# EAGLE schematic tcore (EAGLE 7.4.0)
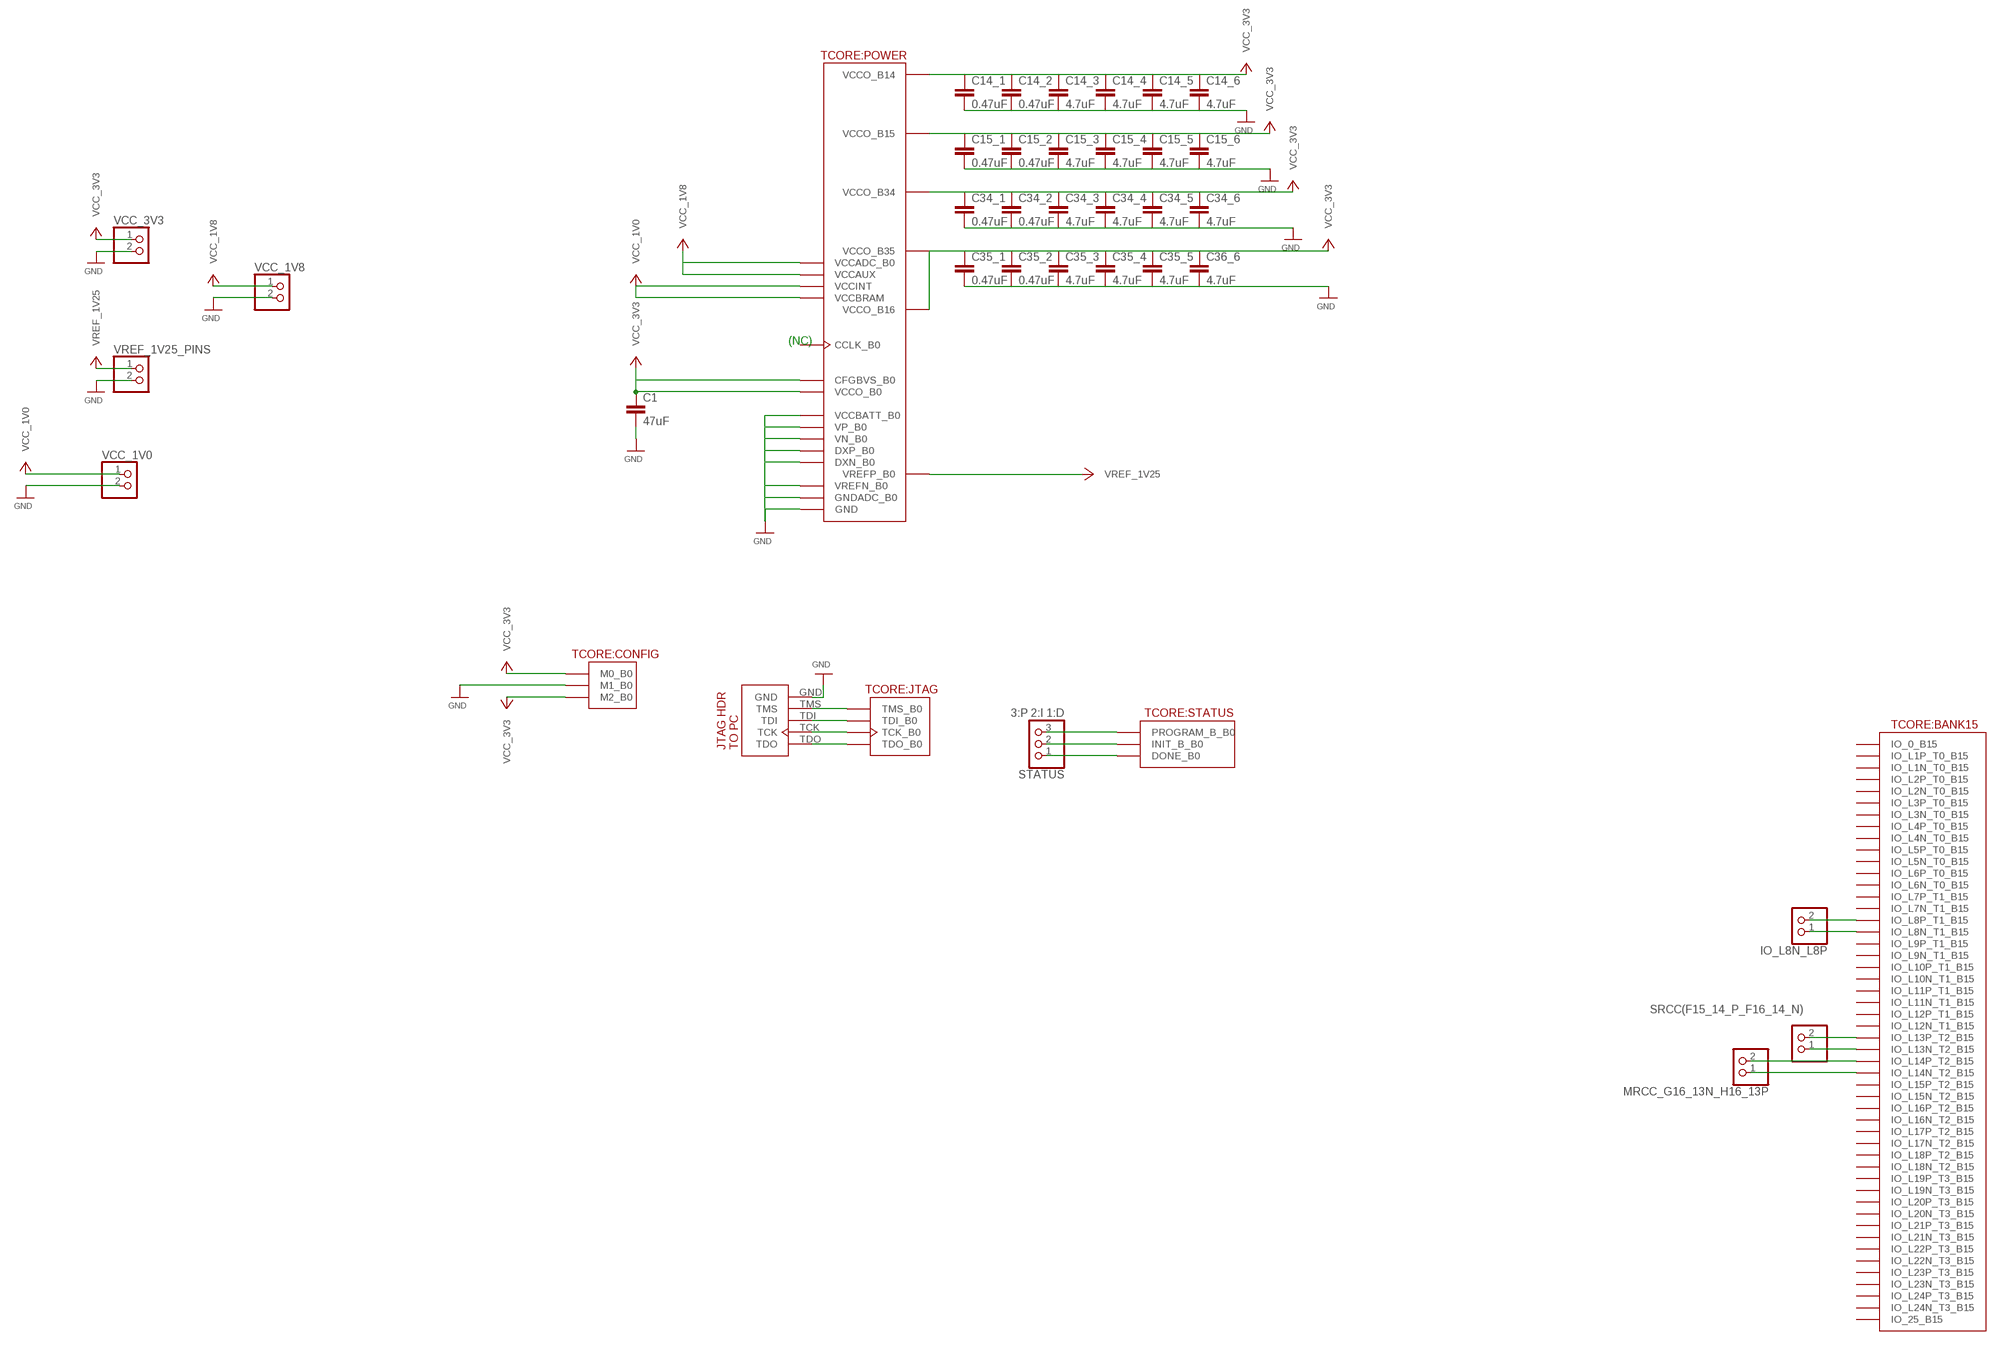
[diagram p0: schematic, sheet 1]

## Parts
C1  47uF  C-EUC1206  [C1206]
C14_1  0.47uF  C-EUC1206  [C1206]
C14_2  0.47uF  C-EUC1206  [C1206]
C14_3  4.7uF  C-EUC1206  [C1206]
C14_4  4.7uF  C-EUC1206  [C1206]
C14_5  4.7uF  C-EUC1206  [C1206]
C14_6  4.7uF  C-EUC1206  [C1206]
C15_1  0.47uF  C-EUC1206  [C1206]
C15_2  0.47uF  C-EUC1206  [C1206]
C15_3  4.7uF  C-EUC1206  [C1206]
C15_4  4.7uF  C-EUC1206  [C1206]
C15_5  4.7uF  C-EUC1206  [C1206]
C15_6  4.7uF  C-EUC1206  [C1206]
C34_1  0.47uF  C-EUC1206  [C1206]
C34_2  0.47uF  C-EUC1206  [C1206]
C34_3  4.7uF  C-EUC1206  [C1206]
C34_4  4.7uF  C-EUC1206  [C1206]
C34_5  4.7uF  C-EUC1206  [C1206]
C34_6  4.7uF  C-EUC1206  [C1206]
C35_1  0.47uF  C-EUC1206  [C1206]
C35_2  0.47uF  C-EUC1206  [C1206]
C35_3  4.7uF  C-EUC1206  [C1206]
C35_4  4.7uF  C-EUC1206  [C1206]
C35_5  4.7uF  C-EUC1206  [C1206]
C36_6  4.7uF  C-EUC1206  [C1206]
IO_L8N_L8P  PINHD-1X2  [1X02]
JTAG_HEADER1  JTAG_HEADER  [JTAG_HDR]
MRCC_G16_13N_H16_13P  PINHD-1X2  [1X02]
SRCC(F15_14_P_F16_14_N)  PINHD-1X2  [1X02]
STATUS  3:P 2:I 1:D  PINHD-1X3  [1X03]
TCORE  TCORECFG324  [TCORE_PAC]
VCC_1V0  PINHD-1X2  [1X02]
VCC_1V8  PINHD-1X2  [1X02]
VCC_3V3  PINHD-1X2  [1X02]
VREF_1V25_PINS  PINHD-1X2  [1X02]

## Nets
GND: C1.2 C14_1.2 C15_1.2 C34_1.2 C35_1.2 JTAG_HEADER1.GND TCORE.E08@VCCBATT_B0(VCCBATT_B0) TCORE.H09@GNDADC_B0(GNDADC_B0) TCORE.J09@VREFN_0(VREFN_B0) TCORE.J10@VP_0(VP_B0) TCORE.K09@VN_B0(VN_B0) TCORE.L09@DXN_B0(DXN_B0) TCORE.L10@DXP_B0(DXP_B0) TCORE.P13@M1_B0(M1_B0) VCC_1V0.2 VCC_1V8.2 VCC_3V3.2 VREF_1V25_PINS.2
N$3: JTAG_HEADER1.TDO TCORE.E13@TDO_B0(TDO_B0)
N$4: JTAG_HEADER1.TCK TCORE.E10@TCK_B0(TCK_B0)
N$5: JTAG_HEADER1.TDI TCORE.E11@TDI_B0(TDI_B0)
N$6: JTAG_HEADER1.TMS TCORE.E12@TMS_B0(TMS_B0)
N$11: STATUS.3 TCORE.P09@PROGRAM_B_B0(PROGRAM_B_B0)
N$15: STATUS.2 TCORE.P07@INIT_B_B0(INIT_B_B0)
N$16: STATUS.1 TCORE.P10@DONE_B0(DONE_B0)
N$20: IO_L8N_L8P.2 TCORE.A15@IO_L8P_T1_B15(IO_L8P_T1_B15)
N$23: MRCC_G16_13N_H16_13P.1 TCORE.F16@IO_L14N_T2_B15(IO_L14N_T2_B15)
N$24: MRCC_G16_13N_H16_13P.2 TCORE.F15@IO_L14P_T2_B15(IO_L14P_T2_B15)
N$25: SRCC(F15_14_P_F16_14_N).1 TCORE.G16@IO_L13N_T2_B15(IO_L13N_T2_B15)
N$26: SRCC(F15_14_P_F16_14_N).2 TCORE.H16@IO_L13P_T2_B15(IO_L13P_T2_B15)
N$28: IO_L8N_L8P.1 TCORE.A16@IO_L8N_T1_B15(IO_L8N_T1_B15)
VCC_1V0 [VCC_1V0]: TCORE.F08@VCCINT(VCCINT) TCORE.F10@VCCBRAM(VCCBRAM) TCORE.G07@VCCINT(VCCINT) TCORE.G09@VCCINT(VCCINT) TCORE.G11@VCCBRAM(VCCBRAM) TCORE.H08@VCCINT(VCCINT) TCORE.J07@VCCINT(VCCINT) TCORE.J11@VCCINT(VCCINT) TCORE.K08@VCCINT(VCCINT) TCORE.L07@VCCINT(VCCINT) TCORE.L11@VCCINT(VCCINT) TCORE.M08@VCCINT(VCCINT) TCORE.M10@VCCINT(VCCINT) TCORE.N07@VCCINT(VCCINT) TCORE.N09@VCCINT(VCCINT) TCORE.N11@VCCINT(VCCINT) VCC_1V0.1
VCC_1V8: TCORE.F12@VCCAUX(VCCAUX) TCORE.H10@VCCADC_B0(VCCADC_B0) TCORE.H12@VCCAUX(VCCAUX) TCORE.K12@VCCAUX(VCCAUX) TCORE.M12@VCCAUX(VCCAUX) VCC_1V8.1
VCC_3V3: TCORE.P11@M2_B0(M2_B0) TCORE.P12@M0_B0(M0_B0)
VCCO_B14 [VCC_3V3]: C1.1 TCORE.B10@VCCO_B16(VCCO_B16) TCORE.L17@VCCO_B14(VCCO_B14) TCORE.N13@VCCO_14(VCCO_B14) TCORE.P08@CFGBVS_0B(CFGBVS_B0) TCORE.P16@VCCO_14(VCCO_B14) TCORE.R09@VCCO_B0(VCCO_B0) TCORE.T12@VCCO_B14(VCCO_B14) TCORE.U15@VCCO_B14(VCCO_B14) TCORE.V18@VCCO_B14(VCCO_B14) VCC_3V3.1 ; supply symbol labelled VCC_3V3
VREF_1V25 [VREF_1V25]: TCORE.K10@VREFP_B0(VREFP_B0) VREF_1V25_PINS.1
Unconnected: C14_1.1 C14_2.1 C14_2.2 C14_3.1 C14_3.2 C14_4.1 C14_4.2 C14_5.1 C14_5.2 C14_6.1 C14_6.2 C15_1.1 C15_2.1 C15_2.2 C15_3.1 C15_3.2 C15_4.1 C15_4.2 C15_5.1 C15_5.2 C15_6.1 C15_6.2 C34_1.1 C34_2.1 C34_2.2 C34_3.1 C34_3.2 C34_4.1 C34_4.2 C34_5.1 C34_5.2 C34_6.1 C34_6.2 C35_1.1 C35_2.1 C35_2.2 C35_3.1 C35_3.2 C35_4.1 C35_4.2 C35_5.1 C35_5.2 C36_6.1 C36_6.2 TCORE.A01@IO_L9N_T1_B35(IO_L9N_T1_B35) TCORE.A03@IO_L8N_T1_B35(IO_L8N_T1_B35) TCORE.A04@IO_L8P_T1_B35(IO_L8P_T1_B35) TCORE.A05@IO_L3N_T0_B35(IO_L3N_T0_B35) TCORE.A06@IO_L3P_T0_B35(IO_L3P_T0_B35) TCORE.A08@IO_L12N_T1_B16(IO_L12N_T1_B16) TCORE.A09@IO_L14N_T2_B16(IO_L14N_T2_B16) TCORE.A10@IO_L14P_T2_B16(IO_L14P_T2_B16) TCORE.A11@IO_L4N_T0_B15(IO_L4N_T0_B15) TCORE.A13@IO_L9P_T1_B15(IO_L9P_T1_B15) TCORE.A14@IO_L9N_T1_B15(IO_L9N_T1_B15) TCORE.A18@IO_L10N_T1_B15(IO_L10N_T1_B15) TCORE.B01@IO_L9P_T1_B35(IO_L9P_T1_B35) TCORE.B02@IO_L10N_T1_B35(IO_L10N_T1_B35) TCORE.B03@IO_L10P_T1_B35(IO_L10P_T1_B35) TCORE.B04@IO_L7N_T1_B35(IO_L7N_T1_B35) TCORE.B06@IO_L2N_T0_B35(IO_L2N_T0_B35) TCORE.B07@IO_L2P_T0_B35(IO_L2P_T0_B35) TCORE.B08@IO_L12P_T1_B16(IO_L12P_T1_B16) TCORE.B09@IO_L11N_T1_B16(IO_L11N_T1_B16) TCORE.B11@IO_L4P_T0_B15(IO_L4P_T0_B15) TCORE.B12@IO_L3N_T0_B15(IO_L3N_T0_B15) TCORE.B13@IO_L2P_T0_B15(IO_L2P_T0_B15) TCORE.B14@IO_L2N_T0_B15(IO_L2N_T0_B15) TCORE.B16@IO_L7P_T1_B15(IO_L7P_T1_B15) TCORE.B17@IO_L7N_T1_B15(IO_L7N_T1_B15) TCORE.B18@IO_L10P_T1_B15(IO_L10P_T1_B15) TCORE.C01@IO_L16N_T2_B35(IO_L16N_T2_B35) TCORE.C02@IO_L16P_T2_B35(IO_L16P_T2_B35) TCORE.C04@IO_L7P_T1_B35(IO_L7P_T1_B35) TCORE.C05@IO_L1N_T0_B35(IO_L1N_T0_B35) TCORE.C06@IO_L1P_T0_B35(IO_L1P_T0_B35) TCORE.C07@IO_L4N_T0_B35(IO_L4N_T0_B35) TCORE.C09@IO_L11P_T1_B16(IO_L11P_T1_B16) TCORE.C10@IO_L13N_T2_B16(IO_L13N_T2_B16) TCORE.C11@IO_L13P_T2_B16(IO_L13P_T2_B16) TCORE.C12@IO_L3P_T0_B15(IO_L3P_T0_B15) TCORE.C14@IO_L1N_T0_B15(IO_L1N_T0_B15) TCORE.C15@IO_L12N_T1_B15(IO_L12N_T1_B15) TCORE.C16@IO_L20P_T3B15(IO_L20P_T3_B15) TCORE.C17@IO_L20N_T3_B15(IO_L20N_T3_B15) TCORE.D02@IO_L14N_T2_B35(IO_L14N_T2_B35) TCORE.D03@IO_L12N_T1_B35(IO_L12N_T1_B35) TCORE.D04@IO_L11N_T1_B35(IO_L11N_T1_B35) TCORE.D05@IO_L11P_T1_B35(IO_L11P_T1_B35) TCORE.D07@IO_L6N_T0_VREF_B35(IO_L6N_T0_B35) TCORE.D08@IO_L4P_T0_B35(IO_L4P_T0_B35) TCORE.D09@IO_L6N_T0_VREF_B16(IO_L6N_T0_B16) TCORE.D10@IO_L19N_T3_VREF_B16(IO_L19N_T3_B16) TCORE.D12@IO_L6P_T0_B15(IO_L6P_T0_B15) TCORE.D13@IO_L6N_T0_VREF_B15(IO_L6N_T0_B15) TCORE.D14@IO_L1P_T0_B15(IO_L1P_T0_B15) TCORE.D15@IO_L12P_T1_B15(IO_L12P_T1_B15) TCORE.D17@IO_L16N_T2_B15(IO_L16N_T2_B15) TCORE.D18@IO_L21N_T3_B15(IO_L21N_T3_B15) TCORE.E01@IO_L18N_T2_B35(IO_L18N_T2_B35) TCORE.E02@IO_L14P_T2_B35(IO_L14P_T2_B35) TCORE.E03@IO_L12P_T1_B35(IO_L12P_T1_B35) TCORE.E05@IO_L5N_T0_B35(IO_L5N_T0_B35) TCORE.E06@IO_L5P_T0_B35(IO_L5P_T0_B35) TCORE.E07@IO_L6P_T0_B35(IO_L6P_T0_B35) TCORE.E09@CCLK_B0(CCLK_B0) TCORE.E15@IO_L11P_T1_B15(IO_L11P_T1_B15) TCORE.E16@IO_L11N_T1_B15(IO_L11N_T1_B15) TCORE.E17@IO_L16P_T2_B15(IO_L16P_T2_B15) TCORE.E18@IO_L21P_T3_B15(IO_L21P_T3_B15) TCORE.F01@IO_L18P_T2_B35(IO_L18P_T2_B35) TCORE.F03@IO_L13N_T2_B35(IO_L13N_T2_B35) TCORE.F04@IO_L13P_T2_B35(IO_L13P_T2_B35) TCORE.F05@IO_0_B35(IO_0_B35) TCORE.F06@IO_L19N_T3_VREF_B35(IO_L19N_T3_B35) TCORE.F13@IO_L5P_T0_B15(IO_L5P_T0_B15) TCORE.F14@IO_L5N_T0_B15(IO_L5N_T0_B15) TCORE.F18@IO_L22N_T3_B15(IO_L22N_T3_B15) TCORE.G01@IO_L17N_T2_B35(IO_L17N_T2_B35) TCORE.G02@IO_L15N_T2_B5(IO_L15N_T2_B35) TCORE.G03@IO_L20N_T3_B35(IO_L20N_T3_B35) TCORE.G04@IO_L20P_T3_B35(IO_L20P_T3_B35) TCORE.G06@IO_L19P_T3_B35(IO_L19P_T3_B35) TCORE.G13@IO_0_B15(IO_0_B15) TCORE.G14@IO_L15N_T2_B15(IO_L15N_T2_B15) TCORE.G17@IO_L18N_T2_B15(IO_L18N_T2_B15) TCORE.G18@IO_L22P_T3_B15(IO_L22P_T3_B15) TCORE.H01@IO_L17P_T2_B35(IO_L17P_T2_B35) TCORE.H02@IO_L15P_T2_B35(IO_L15P_T2_B35) TCORE.H04@IO_L21N_T3_B35(IO_L21N_T3_B35) TCORE.H05@IO_L24N_T3_B35(IO_L24N_T3_B35) TCORE.H06@IO_L24P_T3_B35(IO_L24P_T3_B35) TCORE.H14@IO_L15P_T2_B15(IO_L15P_T2_B15) TCORE.H15@IO_L19N_T3_VREF_B15(IO_L19N_T3_B15) TCORE.H17@IO_L18P_T2_B15(IO_L18P_T2_B15) TCORE.J02@IO_L22N_T3_B35(IO_L22N_T3_B35) TCORE.J03@IO_L22P_T3_B35(IO_L22P_T3_B35) TCORE.J04@IO_L21P_T3_B35(IO_L21P_T3_B35) TCORE.J05@IO_25_B35(IO_25_B35) TCORE.J13@IO_L17N_T2_B15(IO_L17N_T2_B15) TCORE.J14@IO_L19P_T3_B15(IO_L19P_T3_B15) TCORE.J15@IO_L24N_T3_B15(IO_L24N_T3_B15) TCORE.J17@IO_L23P_T3_B15(IO_L23P_T3_B15) TCORE.J18@IO_L23N_T3_B15(IO_L23N_T3_B15) TCORE.K01@IO_L23N_T3_B35(IO_L23N_T3_B35) TCORE.K02@IO_L23P_T3_B35(IO_L23P_T3_B35) TCORE.K03@IO_L2P_T0_B34(IO_L2P_T0_B34) TCORE.K05@IO_L5P_T0_B34(IO_L5P_T0_B34) TCORE.K06@IO_0_B34(IO_0_B34) TCORE.K13@IO_L17P_T2_B15(IO_L17P_T2_B15) TCORE.K15@IO_L24P_T3_B15(IO_L24P_T3_B15) TCORE.K16@IO_25_B15(IO_25_B15) TCORE.K17@IO_L1P_T0_B14(IO_L1P_T0_B14) TCORE.K18@IO_L1N_T0_B14(IO_L1N_T0_B14) TCORE.L01@IO_L1P_T0_34(IO_L1P_T0_B34) TCORE.L03@IO_L2N_T0_B34(IO_L2N_T0_B34) TCORE.L04@IO_L5N_T0_B34(IO_L5N_T0_B34) TCORE.L05@IO_L6N_T0_VREF_B34(IO_L6N_T0_B34) TCORE.L06@IO_L6P_T0_B34(IO_L6P_T0_B34) TCORE.L13@IO_L6P_T0_B14(IO_L6P_T0_B14) TCORE.L14@IO_L2P_T0_B14(IO_L2P_T0_B14) TCORE.L15@IO_L3P_T0_B14(IO_L3P_T0_B14) TCORE.L16@IO_L3N_T0_B14(IO_L3N_T0_B14) TCORE.L18@IO_L4P_T0_B14(IO_L4P_T0_B14) TCORE.M01@IO_L1N_T0_B34(IO_L1N_T0_B34) TCORE.M02@IO_L4N_T0_B34(IO_L4N_T0_B34) TCORE.M03@IO_L4P_T0_B34(IO_L4P_T0_B34) TCORE.M04@IO_L16P_T2_B34(IO_L16P_T2_B34) TCORE.M06@IO_L18P_T2_B34(IO_L18P_T2_B34) TCORE.M13@IO_L6N_T0_VREF_B14(IO_L6N_T0_B14) TCORE.M14@IO_L2N_T0_B14(IO_L2N_T0_B14) TCORE.M16@IO_L10P_T1_B14(IO_L10P_T1_B14) TCORE.M17@IO_L10N_T1_B14(IO_L10N_T1_B14) TCORE.M18@IO_L4N_T0_B14(IO_L4N_T0_B14) TCORE.N01@IO_L3N_T0_B34(IO_L3N_T0_B34) TCORE.N02@IO_L3P_T0_B34(IO_L3P_T0_B34) TCORE.N04@IO_L16N_T2_B34(IO_L16N_T2_B34) TCORE.N05@IO_L13P_T2_B34(IO_L13P_T2_B34) TCORE.N06@IO_L18N_T2_B34(IO_L18N_T2_B34) TCORE.N14@IO_L8P_T1_B14(IO_L8P_T1_B14) TCORE.N15@IO_L11P_T1_B14(IO_L11P_T1_B14) TCORE.N16@IO_L11N_T1_B14(IO_L11N_T1_B14) TCORE.N17@IO_L9P_T1_B14(IO_L9P_T1_B14) TCORE.P02@IO_L15P_T2_B34(IO_L15P_T2_B34) TCORE.P03@IO_L14N_T2_B34(IO_L14N_T2_B34) TCORE.P04@IO_L14P_T2_B34(IO_L14P_T2_B34) TCORE.P05@IO_L13N_T2_B34(IO_L13N_T2_B34) TCORE.P14@IO_L8N_T1_B14(IO_L8N_T1_B14) TCORE.P15@IO_L13P_T2_B14(IO_L13P_T2_B14) TCORE.P17@IO_L12P_T1_B14(IO_L12P_T1_B14) TCORE.P18@IO_L9N_T1_B14(IO_L9N_T1_B14) TCORE.R01@IO_L17P_T2_B34(IO_L17P_T2_B34) TCORE.R02@IO_L15N_T2_B34(IO_L15N_T2_B34) TCORE.R03@IO_L11P_T1_B34(IO_L11P_T1_B34) TCORE.R05@IO_L19N_T3_VREF_B34(IO_L19N_T3_B34) TCORE.R06@IO_L19P_T3_B34(IO_L19P_T3_B34) TCORE.R07@IO_L23P_T3_B34(IO_L23P_T3_B34) TCORE.R08@IO_L24P_T3_B34(IO_L24P_T3_B34) TCORE.R10@IO_25_B14(IO_25_B14) TCORE.R11@IO_0_B14(IO_0_B14) TCORE.R12@IO_L5P_T0_B14(IO_L5P_T0_B14) TCORE.R13@IO_L5N_T0_B14(IO_L5N_T0_B14) TCORE.R15@IO_L13N_T2_B14(IO_L13N_T2_B14) TCORE.R16@IO_L15P_T2_B_14(IO_L15P_T2_B14) TCORE.R17@IO_L12N_T1_B14(IO_L12N_T1_B14) TCORE.R18@IO_L7P_T1_B14(IO_L7P_T1_B14) TCORE.T01@IO_L17N_T2_B34(IO_L17N_T2_B34) TCORE.T03@IO_L11N_T1_B34(IO_L11N_T1_B34) TCORE.T04@IO_L12N_T1_B34(IO_L12N_T1_B34) TCORE.T05@IO_L12P_T1_B34(IO_L12P_T1_B34) TCORE.T06@IO_L23N_T3_B34(IO_L23N_T3_B34) TCORE.T08@IO_L24N_T3_B34(IO_L24N_T3_B34) TCORE.T09@IO_L24P_T3_B14(IO_L24P_T3_B14) TCORE.T10@IO_L24N_T3_B14(IO_L24N_T3_B14) TCORE.T11@IO_L19P_T3_B14(IO_L19P_T3_B14) TCORE.T13@IO_L23P_T3_B14(IO_L23P_T3_B14) TCORE.T14@IO_L14P_T2_B14(IO_L14P_T2_B14) TCORE.T15@IO_L14N_T2_B14(IO_L14N_T2_B14) TCORE.T16@IO_L15N_T2_B14(IO_L15N_T2_B14) TCORE.T18@IO_L7N_T1_B14(IO_L7N_T1_B14) TCORE.U01@IO_L7P_T1_B34(IO_L7P_T1_B34) TCORE.U02@IO_L9P_T1_B34(IO_L9P_T1_B34) TCORE.U03@IO_L8N_T1_B34(IO_L8N_T1_B34) TCORE.U04@IO_L8P_T1_B34(IO_L8P_T1_B34) TCORE.U06@IO_L22N_T3_B34(IO_L22N_T3_B34) TCORE.U07@IO_L22P_T3_B34(IO_L22P_T3_B34) TCORE.U08@IO_25_B34(IO_25_B34) TCORE.U09@IO_L21P_T3_B34(IO_L21P_T3_B34) TCORE.U11@IO_L19N_T3_VREF_B14(IO_L19N_T3_B14) TCORE.U12@IO_L20P_T3_B14(IO_L20P_T3_B14) TCORE.U13@IO_L23N_T3_B14(IO_L23N_T3_B14) TCORE.U14@IO_L22P_T3_B14(IO_L22P_T3_B14) TCORE.U16@IO_L18P_T2_B14(IO_L18P_T2_B14) TCORE.U17@IO_L17P_T2_B14(IO_L17P_T2_B14) TCORE.U18@IO_L17N_T2_B14(IO_L17N_T2_B14) TCORE.V01@IO_L7N_T1_B34(IO_L7N_T1_B34) TCORE.V02@IO_L9N_T1_B34(IO_L9N_T1_B34) TCORE.V04@IO_L10N_T1_B34(IO_L10N_T1_B34) TCORE.V05@IO_L10P_T1_B34(IO_L10P_T1_B34) TCORE.V06@IO_L20N_T3_B34(IO_L20N_T3_B34) TCORE.V07@IO_L20P_T3_B34(IO_L20P_T3_B34) TCORE.V09@IO_L21N_T3_B34(IO_L21N_T3_B34) TCORE.V10@IO_L21P_T3_B14(IO_L21P_T3_B14) TCORE.V11@IO_L21N_T3_B14(IO_L21N_T3_B14) TCORE.V12@IO_L20N_T3_B14(IO_L20N_T3_B14) TCORE.V14@IO_L22N_T3_B14(IO_L22N_T3_B14) TCORE.V15@IO_L16P_T2_B14(IO_L16P_T2_B14) TCORE.V16@IO_L16N_T2_B14(IO_L16N_T2_B14) TCORE.V17@IO_L18N_T2_B14(IO_L18N_T2_B14)

## Notes on the sheet
- (NC)

## Power pins joined to a net without a drawn wire
GND: TCORE.A02@GND(GND) TCORE.A12@GND(GND) TCORE.B05@GND(GND) TCORE.B15@GND(GND) TCORE.C08@GND(GND) TCORE.C18@GND(GND) TCORE.D01@GND(GND) TCORE.D11@GND(GND) TCORE.E04@GND(GND) TCORE.E14@GND(GND) TCORE.F07@GND(GND) TCORE.F09@GND(GND) TCORE.F11@GND(GND) TCORE.F17@GND(GND) TCORE.G08@GND(GND) TCORE.G10@GND(GND) TCORE.G12@GND(GND) TCORE.H03@GND(GND) TCORE.H07@GND(GND) TCORE.H11@GND(GND) TCORE.H13@GND(GND) TCORE.J06@GND(GND) TCORE.J08@GND(GND) TCORE.J12@GND(GND) TCORE.J16@GND(GND) TCORE.K07@GND(GND) TCORE.K11@GND(GND) TCORE.L02@GND(GND) TCORE.L08@GND(GND) TCORE.L12@GND(GND) TCORE.M05@GND(GND) TCORE.M07@GND(GND) TCORE.M09@GND(GND) TCORE.M11@GND(GND) TCORE.M15@GND(GND) TCORE.N08@GND(GND) TCORE.N10@GND(GND) TCORE.N12@GND(GND) TCORE.N18@GND(GND) TCORE.P01@GND(GND) TCORE.R04@GND(GND) TCORE.R14@GND(GND) TCORE.T07@GND(GND) TCORE.T17@GND(GND) TCORE.U10@GND(GND) TCORE.V03@GND(GND) TCORE.V13@GND(GND)
VCCO_B15: TCORE.A17@VCCO_B15(VCCO_B15) TCORE.C13@VCCO_B15(VCCO_B15) TCORE.D16@VCCO_B15(VCCO_B15) TCORE.G15@VCCO_15(VCCO_B15) TCORE.H18@VCCO_B15(VCCO_B15) TCORE.K14@VCCO_B15(VCCO_B15)
VCCO_B34: TCORE.K04@VCCO_B34(VCCO_B34) TCORE.N03@VCCO_B34(VCCO_B34) TCORE.P06@VCCO_B34(VCCO_B34) TCORE.T02@VCCO_B34(VCCO_B34) TCORE.U05@VCCO_B34(VCCO_B34) TCORE.V08@VCCO_B34(VCCO_B34)
VCCO_B35: TCORE.A07@VCCO_B35(VCCO_B35) TCORE.C03@VCCO_B35(VCCO_B35) TCORE.D06@VCCO_B35(VCCO_B35) TCORE.F02@VCCO_B35(VCCO_B35) TCORE.G05@VCCO_B35(VCCO_B35) TCORE.J01@VCCO_B35(VCCO_B35)

## Library data of the parts
C1 C14_1-C14_6 C15_1-C15_6 C34_1-C34_6 C35_1-C35_5 C36_6 = rcl:C-EU: CAPACITOR, European symbol
IO_L8N_L8P MRCC_G16_13N_H16_13P SRCC(F15_14_P_F16_14_N) VCC_1V0 VCC_1V8 VCC_3V3 VREF_1V25_PINS = pinhead:PINHD-1X2: PIN HEADER
JTAG_HEADER1 = tcore:JTAG_HEADER: JTAG HEADER (from PC)
STATUS = pinhead:PINHD-1X3: PIN HEADER
TCORE = tcore:TCORE: TCORE

## Net classes
0 default: width 1.25 mm
1 GND: width 1.25 mm
2 VCC_1V0: width 1.25 mm
3 VREF_1V25: width 1.25 mm
4 VCC_1V8: width 1.25 mm
5 VCC_3V3: width 1.25 mm